# EAGLE design design (EAGLE 9.5.1)

## Sheet 1 of 2: DC/DC converters
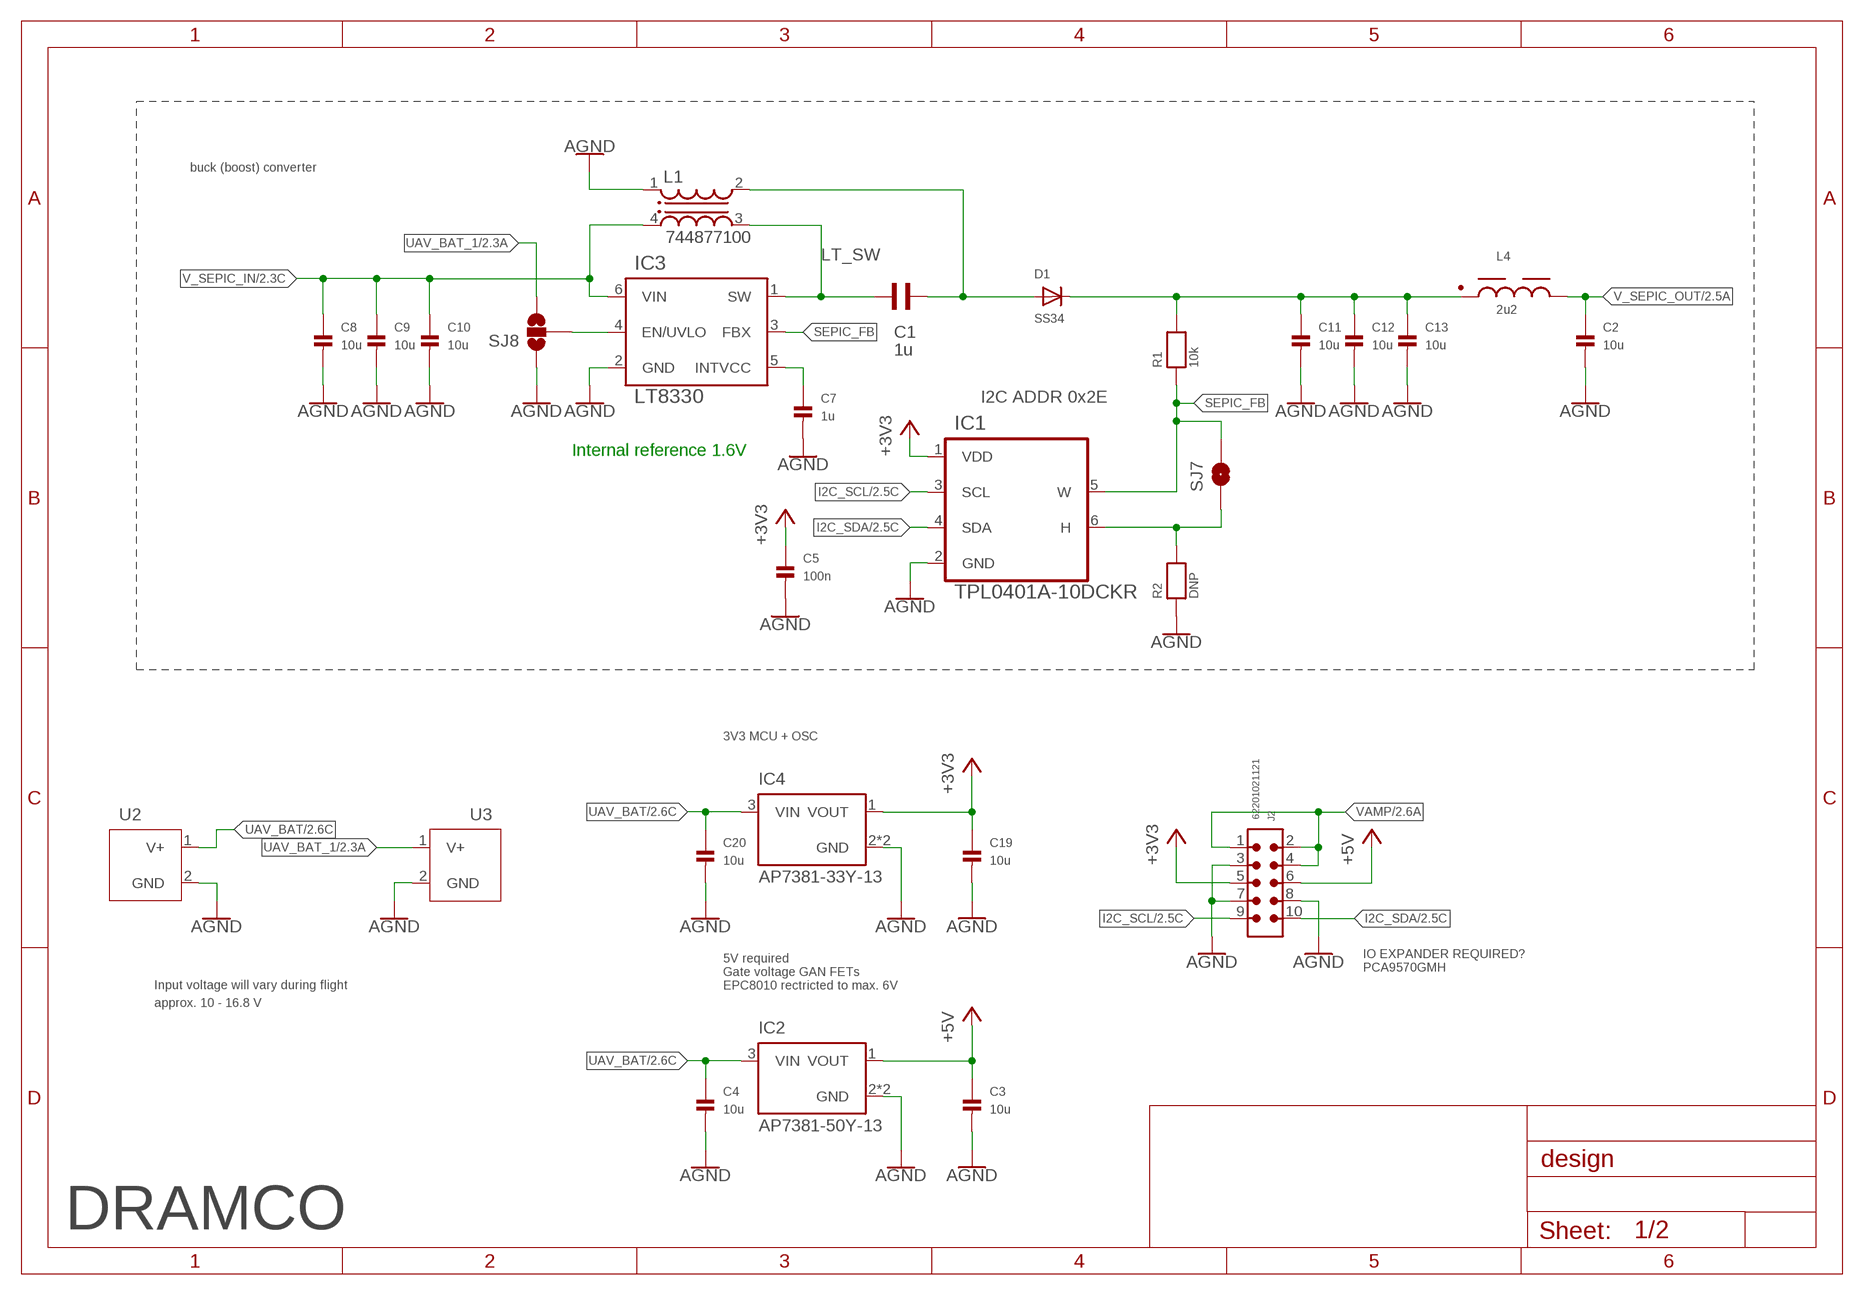
[diagram p0: schematic, sheet 1]

### Parts
C1  1u  WCAP-CSGP_0805_885012207103_WAVE  [WCAP-CSGP_0805_WAVE]
C2  10u  CAP_CERAMIC0805  [0805]
C3  10u  CAP_CERAMIC0603  [0603]
C4  10u  CAP_CERAMIC0603  [0603]
C5  100n  CAP_CERAMIC0402  [0402]
C7  1u  CAP_CERAMIC0603  [0603]
C8  10u  CAP_CERAMIC1206  [1206]
C9  10u  CAP_CERAMIC1206  [1206]
C10  10u  CAP_CERAMIC1206  [1206]
C11  10u  CAP_CERAMIC1206  [1206]
C12  10u  CAP_CERAMIC1206  [1206]
C13  10u  CAP_CERAMIC1206  [1206]
C19  10u  CAP_CERAMIC0603  [0603]
C20  10u  CAP_CERAMIC0603  [0603]
D1  SS34  DIODESOD-123  [SOD-123]
IC1  TPL0401A-10DCKR  [SOT65P210X110-6N]
IC2  AP7381-50Y-13  [FOOT_XC6201P332PR-G]
IC3  LT8330  LT8330ES6TR  [TSOT-23_S6]
IC4  AP7381-33Y-13  AP7381-50Y-13  [FOOT_XC6201P332PR-G]
J2  62201021121  6220XX21121_62201021121  [62201021121]
L1  744877100  WE-DD_7345_744877100  [WE-DD_7345]
L4  2u2  WE-LQS_3015_74404032022  [WE-LQS_3015]
R1  10k  RESISTOR0603  [0603]
R2  DNP  RESISTOR0603  [0603]
SJ7  SOLDERJUMPERNO  [SJ_2S-NO]
SJ8  SOLDERJUMPER_2WAYS  [SJ_3]
U2  UAV-CONNECT  [HOLE]
U3  UAV-CONNECT  [HOLE]

### Nets
+3V3: C5.1 C19.1 IC1.1(VDD) IC4.1(VOUT) J2.5 ; also sheet 2
+5V: C3.1 IC2.1(VOUT) J2.6 ; also sheet 2
AGND: C2.2 C3.2 C4.2 C5.2 C7.2 C8.2 C9.2 C10.2 C11.2 C12.2 C13.2 C19.2 C20.2 IC1.2(GND) IC2.2(GND) IC2.2.1(GND) IC3.2(GND) IC4.2(GND) IC4.2.1(GND) J2.3 J2.7 J2.8 L1.1 R2.1 SJ8.1 U2.2(GND) U3.2(GND) ; also sheet 2
I2C_SCL: IC1.3(SCL) J2.9 ; also sheet 2
I2C_SDA: IC1.4(SDA) J2.10 ; also sheet 2
LT_SW: C1.2 IC3.1(SW) L1.3
N$5: C7.1 IC3.5(INTVCC)
N$6: C1.1 D1.A L1.2
N$7: C11.1 C12.1 C13.1 D1.C L4.1 R1.2
N$8: IC3.4(EN/UVLO) SJ8.2
N$16: IC1.6(H) R2.2 SJ7.1
SEPIC_FB: IC1.5(W) IC3.3(FBX) R1.1 SJ7.2
UAV_BAT: C4.1 C20.1 IC2.3(VIN) IC4.3(VIN) U2.1(V+) ; also sheet 2
UAV_BAT_1: SJ8.3 U3.1(V+) ; also sheet 2
V_SEPIC_IN: C8.1 C9.1 C10.1 IC3.6(VIN) L1.4 ; also sheet 2
V_SEPIC_OUT: C2.1 L4.2 ; also sheet 2
VAMP: J2.1 J2.2 J2.4 ; also sheet 2

### Notes on the sheet
- buck (boost) converter
- I2C ADDR 0x2E
- Internal reference 1.6V
- 3V3 MCU + OSC
- IO EXPANDER REQUIRED?
  PCA9570GMH
- Input voltage will vary during flight
- 5V required
  Gate voltage GAN FETs
  EPC8010 rectricted to max. 6V
- approx. 10 - 16.8 V
- DRAMCO

## Sheet 2 of 2: Current/voltage sensing
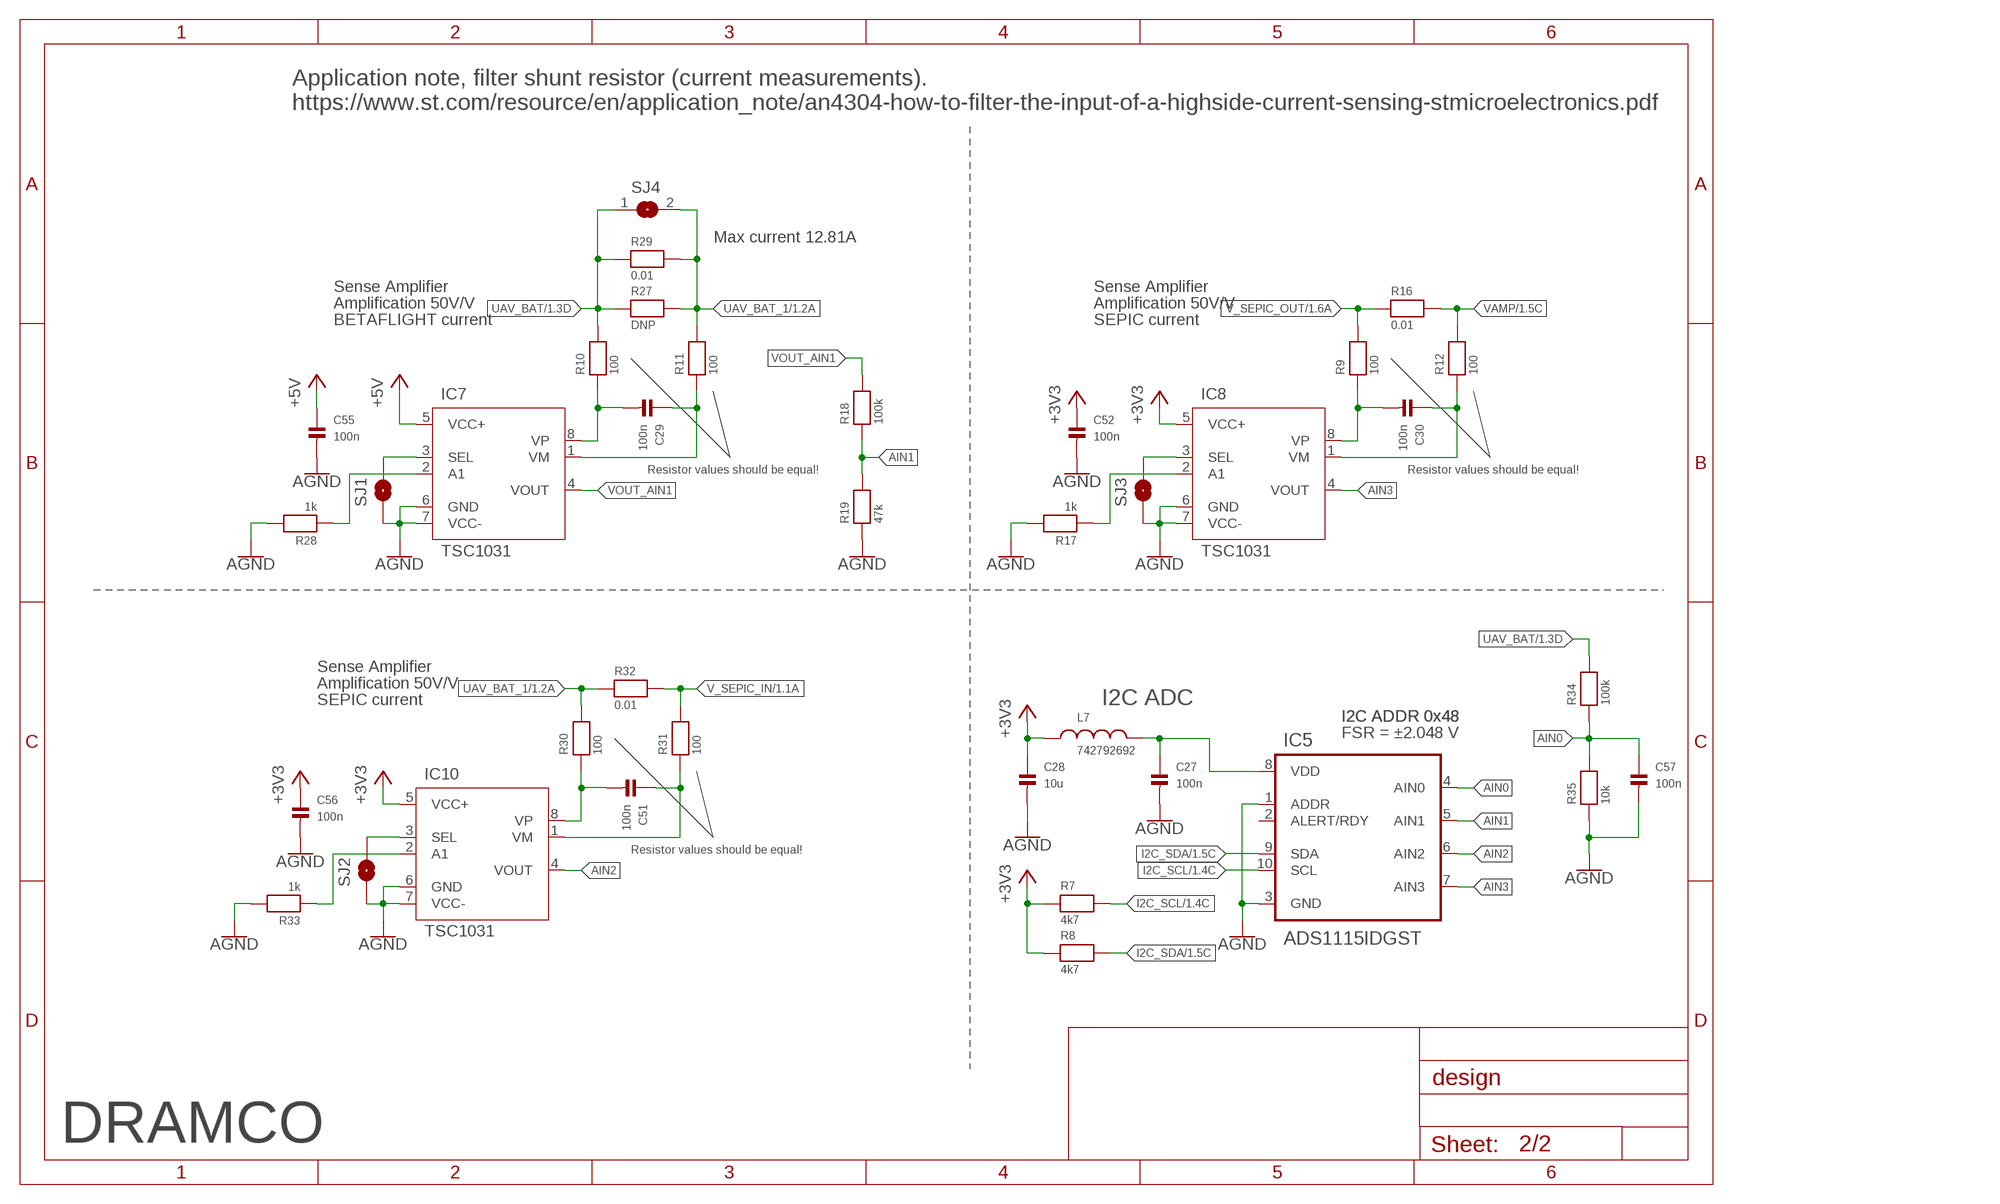
[diagram p1: schematic, sheet 2]

### Parts
C27  100n  CAP_CERAMIC0402  [0402]
C28  10u  CAP_CERAMIC0603  [0603]
C29  100n  CAP_CERAMIC0402  [0402]
C30  100n  CAP_CERAMIC0402  [0402]
C51  100n  CAP_CERAMIC0402  [0402]
C52  100n  CAP_CERAMIC0402  [0402]
C55  100n  CAP_CERAMIC0402  [0402]
C56  100n  CAP_CERAMIC0402  [0402]
C57  100n  CAP_CERAMIC0402  [0402]
IC5  ADS1115IDGST  [SOP50P490X110-10N]
IC7  TSC1031  TSC1031IPT  [SOP65P640X120-8N]
IC8  TSC1031  TSC1031IPT  [SOP65P640X120-8N]
IC10  TSC1031  TSC1031IPT  [SOP65P640X120-8N]
L7  742792692  WE-CBF_0603_742792692_WB_HS  [WE-CBF_0603(W=2.2)]
R7  4k7  RESISTOR0603  [0603]
R8  4k7  RESISTOR0603  [0603]
R9  100  RESISTOR0402  [0402]
R10  100  RESISTOR0402  [0402]
R11  100  RESISTOR0402  [0402]
R12  100  RESISTOR0402  [0402]
R16  0.01  RESISTOR0805  [0805]
R17  1k  RESISTOR0402  [0402]
R18  100k  RESISTOR0603  [0603]
R19  47k  RESISTOR0603  [0603]
R27  DNP  RESISTOR0805  [0805]
R28  1k  RESISTOR0402  [0402]
R29  0.01  RESISTOR0805  [0805]
R30  100  RESISTOR0402  [0402]
R31  100  RESISTOR0402  [0402]
R32  0.01  RESISTOR0805  [0805]
R33  1k  RESISTOR0402  [0402]
R34  100k  RESISTOR0603  [0603]
R35  10k  RESISTOR0603  [0603]
SJ1  SOLDERJUMPERTRACE  [SJ_2S-TRACE]
SJ2  SOLDERJUMPERTRACE  [SJ_2S-TRACE]
SJ3  SOLDERJUMPERTRACE  [SJ_2S-TRACE]
SJ4  SOLDERJUMPERREFLOW  [SOLDERJUMPER_REFLOW]

### Nets
+3V3: C28.1 C52.1 C56.1 IC8.5(VCC+) IC10.5(VCC+) L7.1 R7.1 R8.1 ; also sheet 1
+5V: C55.1 IC7.5(VCC+) ; also sheet 1
AGND: C27.2 C28.2 C52.2 C55.2 C56.2 C57.2 IC5.1(ADDR) IC5.3(GND) IC7.6(GND) IC7.7(VCC-) IC8.6(GND) IC8.7(VCC-) IC10.6(GND) IC10.7(VCC-) R17.2 R19.1 R28.2 R33.2 R35.1 SJ1.1 SJ2.1 SJ3.1 ; also sheet 1
AIN0: C57.1 IC5.4(AIN0) R34.1 R35.2
AIN1: IC5.5(AIN1) R18.1 R19.2
AIN2: IC5.6(AIN2) IC10.4(VOUT)
AIN3: IC5.7(AIN3) IC8.4(VOUT)
I2C_SCL: IC5.10(SCL) R7.2 ; also sheet 1
I2C_SDA: IC5.9(SDA) R8.2 ; also sheet 1
N$3: C30.1 IC8.1(VM) R12.1
N$4: C27.1 IC5.8(VDD) L7.2
N$11: C30.2 IC8.8(VP) R9.1
N$12: IC8.3(SEL) SJ3.2
N$13: IC8.2(A1) R17.1
N$25: IC7.3(SEL) SJ1.2
N$26: C29.1 IC7.1(VM) R11.1
N$27: C29.2 IC7.8(VP) R10.1
N$29: C51.1 IC10.1(VM) R31.1
N$30: C51.2 IC10.8(VP) R30.1
N$31: IC7.2(A1) R28.1
N$32: IC10.3(SEL) SJ2.2
N$33: IC10.2(A1) R33.1
UAV_BAT: R10.2 R27.1 R29.1 R34.2 SJ4.1 ; also sheet 1
UAV_BAT_1: R11.2 R27.2 R29.2 R30.2 R32.1 SJ4.2 ; also sheet 1
V_SEPIC_IN: R31.2 R32.2 ; also sheet 1
V_SEPIC_OUT: R9.2 R16.1 ; also sheet 1
VAMP: R12.2 R16.2 ; also sheet 1
VOUT_AIN1: IC7.4(VOUT) R18.2
Unconnected: IC5.2(ALERT/RDY)

### Notes on the sheet
- Application note, filter shunt resistor (current measurements). 
  https://www.st.com/resource/en/application_note/an4304-how-to-filter-the-input-of-a-highside-current-sensing-stmicroelectronics.pdf
- Max current 12.81A
- Sense Amplifier | Sense Amplifier
- Amplification 50V/V | Amplification 50V/V
- BETAFLIGHT current | SEPIC current
- Resistor values should be equal! | Resistor values should be equal!
- Sense Amplifier
- Amplification 50V/V
- SEPIC current | I2C ADC
- I2C ADDR 0x48 | I2C ADDR 0x48
- FSR = ±2.048 V
- Resistor values should be equal!
- DRAMCO

## Library data of the parts
C1 = Kondensatoren (rev17a):WCAP-CSGP_0805: WCAP-CSGP Ceramic Capacitors Characteristics Multilayer Ceramic Chip Capacitor Recommended soldering:Reflow, for 0603 and 0805 wave soldering is also allowed Operating temperature:-55 °C to +125 °C; Ceramic characteristics: Class I - NPO ; Class II -X7R, X5R High performance ceramic High capacitance stability Minimal aging Termination:Cu/Ni/Sn <http://katalog.we-online.de/media/images/eisos/WCAP-CSGP_pf2.jpg> Details see: http://katalog.we-online.de/en/pbs/WCAP-CSGP-0805? Created: 2015-01-28 2015 (C) Wurth Elektronik
C2-C5 C7-C13 C19 C20 C27-C30 C51 C52 C55-C57 = microbuilder:CAP_CERAMIC: Ceramic Capacitors 0402 - 0402 Surface Mount Capacitors 16pF 50V 5% [Digikey: 445-4899-2-ND] 18pF 50V 5% [Digikey: 490-1281-2-ND] 22pF 50V 5% [Digikey: 490-1283-2-ND] 68pF 50V 5% [Digikey: 490-1289-2-ND] 0.1uF 10V 10% [Digikey: 490-1318-2-ND] 1.0uF 6.3V 10% [Digikey: 490-1320-2-ND] 0603 - 0603 Surface Mount Capacitors 16 pF 50V 5% [Digikey: 445-5051-2-ND] 22 pF 50V [Digikey: PCC220ACVTR-ND] 33 pF 50V 5% [Digikey: 490-1415-1-ND] 56pF 50V 5% [Digikey: 490-1421-1-ND] 220pF 50V 5% [Digikey: 445-1285-1-ND] 680 pF 50V 2200 pF 50V 5% C0G [Digikey: 445-1297-1-ND] 5600 pF 100V 5% X7R [Digikey: 478-3711-1-ND] 0.1 µF 25V 10% [Digikey: PCC2277TR-ND] 0.22 µF 16V 10% X7R [Digikey: 445-1318-1-ND] 1.0 µF 25V 10% [Digikey: 445-5146-2-ND] 0603 - RF Specific 3pF 250V +/-0.1pF RF [Digikey: 712-1347-1-ND] 18 pF 250V 5% [Digikey: 478-3505-1-ND or 712-1322-1-ND] 56 pF 250V 5% C0G RF [Digikey: 490-4867-1-ND] 68 pF 250V RF [Digikey: 490-4868-1-ND] 0805 - 0805 Surface Mount Capacitors 220 pF 250V 2% RF Ceramic Capacitor [Digikey: 712-1398-1-ND] 1000 pF 50V 2% NP0 Ceramic Capacitor [Digikey: 478-3760-1-ND] 0.1 µF 25V 10% Ceramic Capacitor [Digikey: PCC1828TR-ND] 1.0 µF 16V 10% Ceramic Capacitor[Digikey: 490-1691-2-ND] 10.0 µF 10V 10% Ceramic Capacitor[Digikey: 709-1228-1-ND] 10.0 uF 16V 10% Ceramic Capacitor [Digikey: 478-5165-2-ND] 47 uF 6.3V 20% Ceramic Capacitor [Digikey: 587-1779-1-ND or 399-5506-1-ND] 1206 - 1206 Surface Mount Capacitors 47uF 10V 20% Ceramic Capacitor [Digikey: 490-5528-1-ND or 399-5508-1-ND or 445-6010-1-ND] 100uF 6.3V -20%, +80% Y5V Ceramic Capacitor (Digikey: 490-4512-1-ND, Mouser: 81-GRM31CF50J107ZE1L)
D1 = microbuilder:DIODE: Diode SMA Model Volts Amps Type Vf Vr Digikey # Notes SSA34-E3 40V 3A Schottky 480mV @ 3A 200uA @ 40V SSA34-E3/61TGITR-ND CDBA120-G 20V 1A Schottky 500mV @ 1A 500uA @ 20V 641-1014-6-ND REEL MBRA210 10V 2A Schottky 350mV @ 2A 700uA @ 10V MBRA210LT3 SOD-123 Model Volts Amps Type Vf Vr Order # Notes BAT54T1G 30V 200mA Schottky 800mV @ 200mA 2uA @ 25V BAT54T1GOSTR-ND B0530W 30V 500mA Schottky 430mV @ 500mA 130uA @ 30V B0530W-FDICT-ND REEL MBR120 1A 20V Schottky 340mV @ 1A MBR120VLSFT1GOSCT-ND SOD-323 Model Volts Amps Type Vf Vr Order # Notes PMEG2005EJ 20V 500mA Schottky 355mV @ 500mA 568-4110-1-ND ZLLS410 10V 570mA Schottky 380mV @ 570mA ZLLS410CT-ND 1N4148WS 75V 150mA Silicon/Simple 1V 1N4148WSFSCT-ND REEL SOD-523 Model Volts Amps Type Vf Vr Order # Notes BAT54XV2 30V 200mA Schottky 0.8V @ 100mA BAT54XV2CT-ND TB751S 30V 30mA Schottky RB751S-40TE61CT-ND SOT23-R/W (R = Solder Paste/Reflow Ovens, W = Hand-Soldering) Model Volts Amps Type Vf Vr Order # Notes BAT54FILM 40V 300mA Schottky 497-7162-1-ND
IC1 = TPL0401A-10DCKR:TPL0401A-10DCKR: Check availability <https://pricing.snapeda.com/parts/TPL0401A-10DCKR/Texas%20Instruments/view-part?ref=eda>; AVAILABILITY: In Stock; CHECK_PRICES: https://www.snapeda.com/parts/TPL0401A-10DCKR/Texas+Instruments/view-part/?ref=eda; DESCRIPTION: 128-tap single-channel digital potentiometer (digipot) with I2C interface (address 0101110); MF: Texas Instruments; MP: TPL0401A-10DCKR; PACKAGE: SOT-SC70-6 Texas Instruments; PRICE: None; PURCHASE-URL: https://pricing.snapeda.com/search?q=TPL0401A-10DCKR&ref=eda; SNAPEDA_LINK: https://www.snapeda.com/parts/TPL0401A-10DCKR/Texas+Instruments/view-part/?ref=snap
IC2 IC4 = AP7381:AP7381-50Y-13: 250mA CMOS LDO, Isupply 1uA and 2% Vout Accuracy 3 SOT-89 T/R; AVAILABILITY: Unavailable; DESCRIPTION: 250mA CMOS LDO, Isupply 1uA and 2% Vout Accuracy 3 SOT-89 T/R; MF: Microchip; MP: MCP1700T-3602E/MB; PACKAGE: SOT-89 Microchip; PRICE: None
IC3 = LT8330ES6TR:LT8330ES6TR: Check availability <https://pricing.snapeda.com/parts/LT8330ES6%23TR/Analog%20Devices/view-part?ref=eda>; AVAILABILITY: In Stock; CHECK_PRICES: https://www.snapeda.com/parts/LT8330ES6%23TR/Analog+Devices/view-part/?ref=eda; DESCRIPTION: Boost, SEPIC Switching Regulator IC Positive or Negative, Isolation Capable Adjustable 1.6V, -0.8V 1 Output 1A SOT-23-6 Thin, TSOT-23-6; MF: Analog Devices; MP: LT8330ES6#TR; PACKAGE: SOT-23-6 Linear Technology; PRICE: None; SNAPEDA_LINK: https://www.snapeda.com/parts/LT8330ES6%23TR/Analog+Devices/view-part/?ref=snap
IC5 = ADS1115IDGST:ADS1115IDGST: Analog-to-Digital Converter with Internal Reference; AVAILABILITY: Unavailable; DESCRIPTION: 16-Bit ADC with Integrated MUX, PGA, Comparator, Oscillator, and Reference 10-VSSOP -40 to 125; MF: Texas Instruments; MP: ADS1115IDGST; PACKAGE: MSOP-10 Texas Instruments; PRICE: None
IC7 IC8 IC10 = TSC1031:TSC1031IPT
J2 = Eagle_WR-PHD (rev22a):6220XX21121_62201021121: WR-PHD 1.27 mm THT Dual Pin Header ARTICLE PROPERTIES: Pins:4;​ 8;​ 10;​ 14;​ 16;​ 20;​ 28 KIND PROPERTIES: Pitch：1.27 mm Quality Class:3 as per CECC 75 301-802 Rows：Dual Gender：Pin Header Type：Straight MATERIAL PROPERTIES: Insulator Material :PA9T Insulator Flammability Rating:UL94 V-0 Contact Material:Copper Alloy Contact Plating:Gold Contact Type:Stamped GENERAL INFORMATION Operating Temperature:-40 up to +105 °C Compliance:Lead free / RoHS ELECTRICAL PROPERTIES: Rated Current:1 A;​ max. IR1:1 A Withstanding Voltage:500 V (AC) Contact Resistance:20 mΩ RISO:1000 MΩ CERTIFICATION UL Approval:E323964 PACKAGING PROPERTIES Packaging:Box Packaging Unit:1000;​ 800;​ 500;​ 200 <https://katalog.we-online.com/media/images/v2/o33223v209%20Family_WR-PHD_6220xx21121.jpg> Details see: https://katalog.we-online.com/en/em/PHD_1_27_THT_DUAL_PIN_HEADER_6220XX21121 Updated by Yingchun,Shan 2019-10-25 2019 (C) Würth Elektronik; DATASHEET-URL: https://www.we-online.com/redexpert/spec/62201021121?ae; GENDER: Pin Header; IR: 1A; MOUNT: THT; PACKAGING: Box; PART-NUMBER: 62201021121; PINS: 10; PITCH: 1.27mm; ROWS: Dual; TYPE: Straight
L1 = PowerMagnetics (rev18e):WE-DD_7345: WE-DD SMD Shielded Coupled Inductor Characteristics 1:1 transformer Double inductor with two identical windings 4 different sizes available Operating temperature: –40 ºC to +125 ºC Recommended solder profile: Reflow Custom designs on request Applications For SEPIC and CUK topologies Flyback applications Switching regulators with second, unregulated output voltages <http://katalog.we-online.de/media/images/v2/Family_WE-DD.jpg> Details see: http://katalog.we-online.de/en/pbs/WE-DD Updated by Dan Xu 2014-06-10 2014 (C) Wurth Elektronik; WE-NUMBER: 744877100/10uH
L4 = EMCComponents (rev19b):WE-LQS_3015: SMD Shielded Tiny Power Inductor Characteristics Tiny Power Inductor design 1.7 times more current in comparison with unshielded versions Robust design & high durability Low RDC Magnetically shielded with magnetic glue reducing buzz noise in ultra-low levels Operating Temperature: –40 °C to +125 °C Applications Integrated DC/DC Converters Switching controllers which required high efficiency Portable power (Smartphones, digital cameras, Tablets, etc.) Embedded laptops and PCs Big sizes (5040, 60xx, 8040) used for shock-proof circuits <http://katalog.we-online.de/media/images/v2/Family_WE-LQS.jpg> Details see: http://katalog.we-online.de/en/pbs/WE-LQS Created by Dan Xu 2014-05-21 2014 (C) Wurth Elektronik; WE-NUMBER: 74404032022/2,2uH
L7 = PowerMagnetics (rev18e):WE-CBF_0603: WE-CBF SMD EMI Suppression Ferrite Bead Characteristics Reliable Ni-Sn electrodes High rated current up to 6 A Operating temperature: –55 ºC to +125 ºC Applications Perfect as data lined filter and for uncoupling of distribution voltage Variant abbreviation WB means WIDE BAND HS means HIGH SPEED HC means HIGH CURRENT <http://katalog.we-online.de/media/images/v2/Family_WE-CBF.jpg> Details see: http://katalog.we-online.de/en/pbs/WE-CBF Updated on 2014-06-19 2014 (C) Wurth Elektronik; WE-NUMBER: 742792692/1800Ω(Z@100MHz)
R1 R2 R7-R12 R16-R19 R27-R35 = microbuilder:RESISTOR: Resistors 0402 - 0402 Surface Mount Package 22 Ohm 1% 1/16W [Digikey: 311-22.0LRTR-ND] 33 Ohm 5% 1/16W 1.0K 5% 1/16W 1.5K 5% 1/16W 2.0K 1% 1/16W 10.0K 1% 1/16W [Digikey: 311-10.0KLRTR-ND] 10.0K 5% 1/16W [Digikey: RMCF0402JT10K0TR-ND] 12.1K 1% 1/16W [Digikey: 311-22.0LRTR-ND] 100.0K 5% 1/16W 0603 - 0603 Surface Mount Package 0 Ohm 1/10 Watt 1% Resistor 15 Ohm 1/10 Watt 1% Resistor 33 Ohm 1/10 Watt 1% Resistor 49.9 Ohm 1/10 Watt 1% Resistor 100 Ohm 1/10 Watt 1% Resistor 150 Ohm 1/10 Watt 1% Resistor 240 Ohm 1/10 Watt 1% Resistor 390 Ohm 1/10 Watt 1% Resistor 560 Ohm 1/10 Watt 1% Resistor 680 Ohm 1/10 Watt 1% Resistor 750 Ohm 1/10 Watt 1% Resistor 1.0K Ohm 1/10 Watt 1% Resistor 1.5K Ohm 1/10 Watt 1% Resistor 2.0K Ohm 1/10 Watt 1% Resistor 2.2K Ohm 1/10 Watt 1% Resistor 3.3K Ohm 1/10 Watt 1% Resistor 4.7K Ohm 1/10 Watt 1% Resistor 10.0K Ohm 1/10 Watt 1% Resistor 12.0K Ohm 1/10 Watt 1% Resistor 12.1K Ohm 1/10 Watt 1% Resistor 20.0K Ohm 1/10 Watt 1% Resistor 33.0K Ohm 1/10 Watt 1% Resistor 100.0K Ohm 1/10 Watt 1% Resistor 0805 - 0805 Surface Mount Package 0 Ohm 1/8 Watt 1% Resistor 33 Ohm 1/8 Watt 1% Resistor 100 Ohm 1/8 Watt 1% Resistor 150 Ohm 1/8 Watt 1% Resistor 200 Ohm 1/8 Watt 1% Resistor 240 Ohm 1/8 Watt 1% Resistor 330 Ohm 1/8 Watt 1% Resistor 390 Ohm 1/8 Watt 1% Resistor 470 Ohm 1/8 Watt 1% Resistor 1.0K Ohm 1/8 Watt 1% Resistor 1.5K Ohm 1/8 Watt 1% Resistor 2.0K Ohm 1/8 Watt 1% Resistor 4.7K Ohm 1/8 Watt 1% Resistor 5.1K Ohm 1/8 Watt 1% Resistor 5.6K Ohm 1/8 Watt 1% Resistor 10.0K Ohm 1/8 Watt 1% Resistor 22.0K Ohm 1/8 Watt 1% Resistor 33.0K Ohm 1/8 Watt 1% Resistor 100K Ohm 1/8 Watt 1% Resistor 1206 - 1206 Surface Mount Package 2012 - 2010 Surface Mount Package 0.11 Ohm 1/2 Watt 1% Resistor - Digikey: RHM.11UCT-ND
SJ1-SJ3 SJ7 = SparkFun-Retired:SOLDERJUMPER: Solder Jumper Standard SMD solder jumper. Used to automate production. Two varients : Normally Open and Normally Closed are the same, but have different paste layers. NC will have a large amount of paste and should jumper during reflow.
SJ4 = microbuilder:SOLDERJUMPER: SMD Solder JUMPER Solder the two pads together to create a connection, or remove the solder to break it. REFLOW - Use this footprint for solder paste and reflow ovens. WAVE - Use this footprint for hand-soldering (larger pads). CLOSED - Has a trace between the two pads to ensure it is closed by default. The trace needs to be cut to disable the jumper, and can be closed again by creating a solder bridge between the two pads.
SJ8 = SparkFun-Retired:SOLDERJUMPER_2WAY: Solder Jumper 2 way solder jumper
U2 U3 = UAV-connector:UAV-CONNECT

## Board
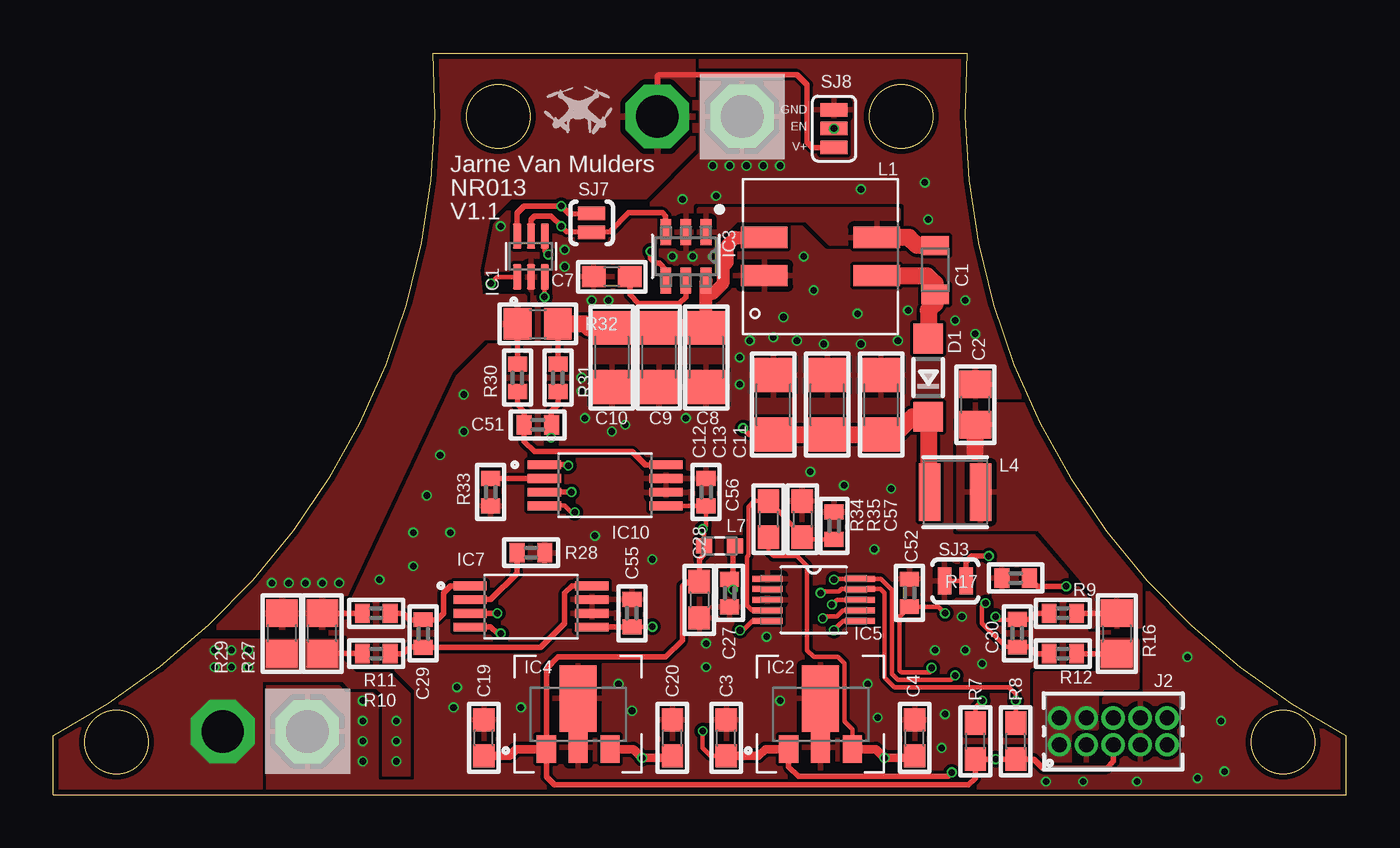
[diagram p2: board, top side]
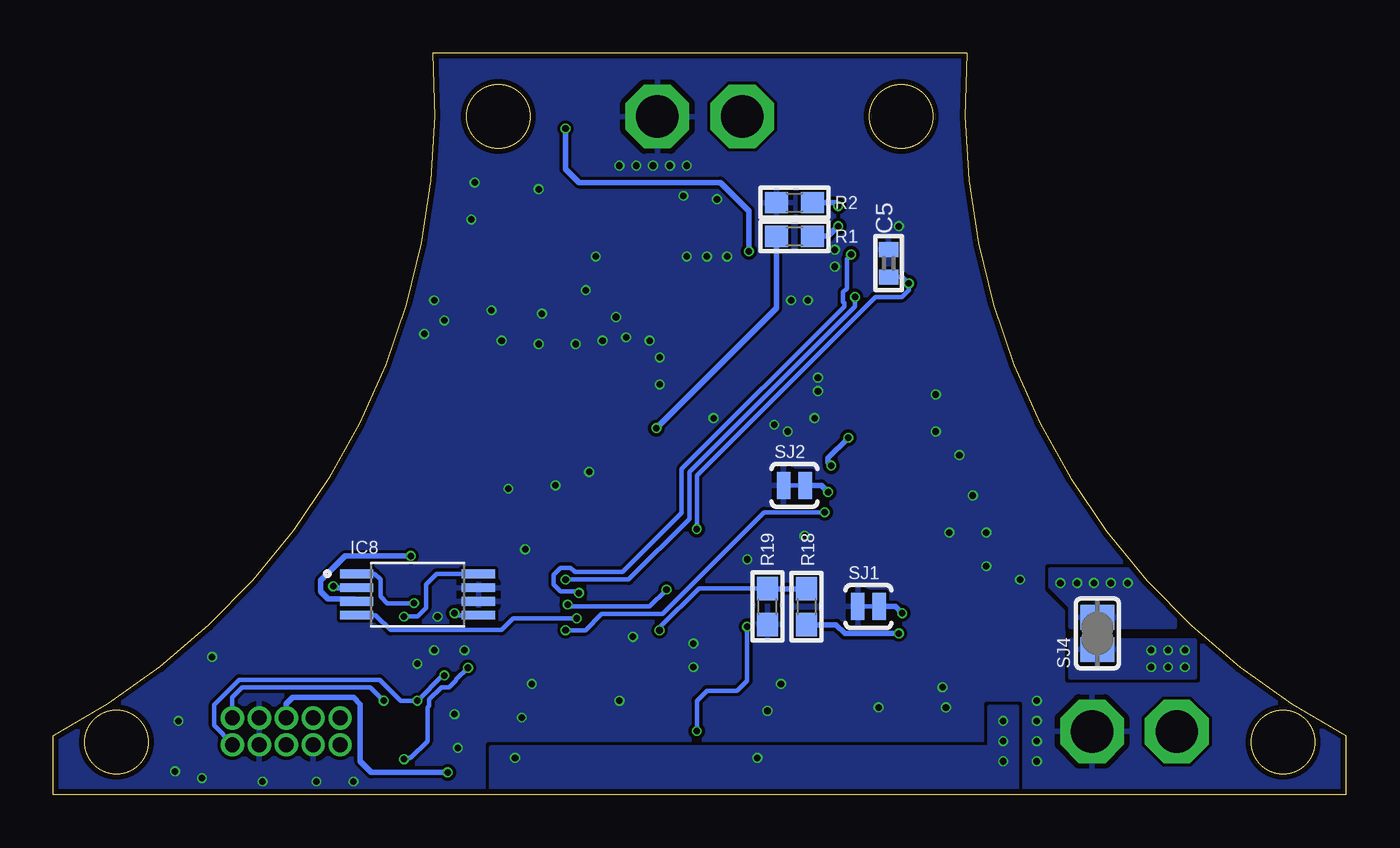
[diagram p3: board, bottom side, seen from below]

Size 61 x 35 mm. Coordinates in mm from the lower left corner, seen from the top.
Outline: 0,0 61,0 61,2.8 arc-67 43.1,35 17.9,35 arc-67 0,2.8 0,0
Outline: circle at 3,2.5 radius 1.5
Outline: circle at 58,2.5 radius 1.5
Outline: circle at 21,32 radius 1.5
Outline: circle at 40,32 radius 1.5
Copper layers (1*16): Top 0.035mm / dielectric 1.5mm / Bottom 0.035mm
Design rules "SeeedStudio_2layer_DRU_no_angle_20140221 *": minimum track width 6mil, minimum drill 12mil, track to track 6mil, track to pad 6mil, pad to pad 6mil, via to via 6mil, smd to smd 0mil, copper to edge 10mil, drill to drill 10mil, minimum pad ring 6mil, minimum via ring 2mil, stop-mask expansion 2mil, vias tented up to drill 100mil, thermal gap 10mil

### Footprints (pad centres in the part's own frame; a part is rotated, then mirrored left to right if it is on the bottom)
WCAP-CSGP_0805_WAVE = smd 0.9 x 1.3: 1 -1.15,0; 2 1.15,0
0805 = smd 1.3 x 1.5: 1 -0.95,0; 2 0.95,0
0603 = smd 1.1 x 1: 1 -0.85,0; 2 0.85,0
0402 = smd 0.7 x 0.9: 1 -0.65,0; 2 0.65,0
1206 = smd 1.6 x 1.8: 1 -1.4,0; 2 1.4,0
SOD-123 = smd 1.4 x 1.4: A 1.85,0; C -1.85,0
SOT65P210X110-6N = smd 1.19 x 0.4: 1 -0.96,0.65; 2 -0.96,0; 3 -0.96,-0.65; 4 0.96,-0.65; 5 0.96,0; 6 0.96,0.65
FOOT_XC6201P332PR-G = smd 0.9 x 1.3: 1 -1.5,-1.65; 3 1.5,-1.65 | smd 0.9 x 1.475: 2 0,-1.562 | smd 1.733 x 3.125: 2.1 0,0.738
TSOT-23_S6 = smd 1.219 x 0.508: 1 -1.143,0.95; 2 -1.143,0; 3 -1.143,-0.95; 4 1.143,-0.95; 5 1.143,0; 6 1.143,0.95
SOP50P490X110-10N = smd 1.422 x 0.279: 1 -2.184,0.991; 2 -2.184,0.508; 3 -2.184,0; 4 -2.184,-0.508; 5 -2.184,-0.991; 6 2.184,-0.991; 7 2.184,-0.508; 8 2.184,0; 9 2.184,0.508; 10 2.184,0.991
SOP65P640X120-8N = smd 1.57 x 0.41: 1 -2.87,0.975; 2 -2.87,0.325; 3 -2.87,-0.325; 4 -2.87,-0.975; 5 2.87,-0.975; 6 2.87,-0.325; 7 2.87,0.325; 8 2.87,0.975
62201021121 = drill 0.7 pad 1.1: 1 -2.54,-0.635; 2 -2.54,0.635; 3 -1.27,-0.635; 4 -1.27,0.635; 5 0,-0.635; 6 0,0.635; 7 1.27,-0.635; 8 1.27,0.635; 9 2.54,-0.635; 10 2.54,0.635
WE-DD_7345 = smd 2.2 x 1: 1 -2.65,-0.9; 2 2.65,-0.9; 3 2.65,0.9; 4 -2.65,0.9
WE-LQS_3015 = smd 1 x 2.7: 1 -1.2,0; 2 1.2,0
WE-CBF_0603(W=2.2) = smd 0.75 x 0.7: 1 -0.725,0; 2 0.725,0
SJ_2S-TRACE = smd 0.635 x 1.27: 1 -0.508,0; 2 0.508,0
SOLDERJUMPER_REFLOW = smd 1.168 x 1.6: 1 -0.762,0; 2 0.762,0
SJ_2S-NO = smd 0.635 x 1.27: 1 -0.45,0; 2 0.45,0
SJ_3 = smd 0.635 x 1.27: 1 -0.889,0; 2 0,0; 3 0.889,0
HOLE = drill 2 octagon: 1 -2,0; 2 2,0

### Placement (x,y rotation side)
C1  41.59,24.77 90 top
C2  43.5,18.41 90 top
C3  31.75,2.7 90 top
C4  40.64,2.7 90 top
C5  21.59,25.08 90 bottom
C7  26.35,24.45 180 top
C8  30.8,20.64 270 top
C9  28.57,20.64 270 top
C10  26.35,20.64 270 top
C11  39.05,18.41 90 top
C12  33.97,18.41 90 top
C13  36.51,18.41 90 top
C19  20.32,2.7 90 top
C20  29.21,2.7 90 top
C27  31.91,9.53 270 top
C28  30.48,9.21 270 top
C29  17.46,7.62 270 top
C30  45.47,7.63 90 top
C51  22.86,17.46 180 top
C52  40.39,9.53 90 top
C55  27.3,8.57 90 top
C56  30.8,14.29 90 top
C57  36.83,12.7 90 top
D1  41.27,19.68 90 top
IC1  22.54,25.4 90 top
IC2  36.2,3.81 0 top
IC3  29.84,25.4 270 top
IC4  24.77,3.81 0 top
IC5  35.88,9.21 0 top
IC7  22.54,8.89 0 top
IC8  43.81,9.46 0 bottom
IC10  26.04,14.61 0 top
J2  50,3 0 top
L1  36.2,25.4 0 top
L4  42.55,14.29 0 top
L7  31.43,11.75 0 top
R1  26.04,26.35 180 bottom
R2  26.04,27.94 0 bottom
R7  43.5,2.54 90 top
R8  45.4,2.54 90 top
R9  47.62,8.57 0 top
R10  15.24,6.67 180 top
R11  15.24,8.57 180 top
R12  47.62,6.67 0 top
R16  50.16,7.62 270 top
R17  45.4,10.23 180 top
R18  25.47,8.88 270 bottom
R19  27.3,8.89 90 bottom
R27  12.7,7.62 90 top
R28  22.54,11.43 0 top
R29  10.79,7.62 90 top
R30  21.91,19.68 90 top
R31  23.81,19.68 90 top
R32  22.86,22.23 0 top
R33  20.64,14.29 270 top
R34  33.74,13.01 270 top
R35  35.33,13.01 270 top
SJ1  22.54,8.89 0 bottom
SJ2  26.04,14.61 0 bottom
SJ3  42.55,10.09 0 top
SJ4  11.75,7.62 90 bottom
SJ7  25.4,26.99 270 top
SJ8  36.83,31.43 270 top
U2  10,3 0 top
U3  30.5,32 0 top

### Tracks (layer width: path | path; a pad name or v marks a point on that pad's centre or on a via)
+3V3  (via drill 0.31)
  Top 0.203: L7.1 30.71,12.47 v30.64,12.54 30.8,12.7 30.8,13.49 | v20.64,24.13 20.95,24.44 IC1.1 | C56.1 30.8,13.49 | IC10.5 30.66,13.63 30.8,13.49 | v41.43,6 41.43,5.87 41.35,5.79 40.01,5.79 39.92,5.87 39.92,8.41 C52.1 41.76,8.88 v42.07,8.57
  Top 0.254: J2.5 50.01,2.36 50.01,1.59 49.69,1.27 46.67,1.27 46.25,1.69 R8.1 v44.45,1.69 R7.1 43.5,0.79 43.18,0.48 23.65,0.48 23.27,0.86 IC4.1 23.27,5.96 23.81,6.51 28.89,6.51 29.69,7.3 29.69,9.84 29.9,10.06 C28.1 30.48,11.11 30.71,11.34 L7.1
  Top 0.406: IC4.1 21.84,2.16 21.53,1.85 C19.1
  Bottom 0.203: v30.64,12.54 30.64,15.08 22.23,23.5 20.95,23.5 20.64,23.81 v20.64,24.13 20.94,24.43 C5.1 | v41.43,6 41.98,5.45 41.98,5.41 42.31,5.08 42.68,5.08 43.25,4.5 43.25,4.21 43.34,4.13 43.34,2.54 44.13,1.75 44.45,1.75 v44.45,1.69 | v42.07,8.57 41.98,8.48 IC8.5
+5V  (via drill 0.31)
  Top 0.152: IC7.5
  Top 0.203: C55.1 28.08,7.92 28.1,7.94 v28.27,7.94 | v30.64,3.02 30.64,2.22 31.01,1.85 C3.1
  Top 0.254: C55.1 IC7.5 | IC2.1 34.7,1.34 35.15,0.88 42.21,0.88 v42.39,1.06
  Top 0.406: IC2.1 33.59,2.16 33.28,1.85 C3.1
  Bottom 0.203: v28.27,7.94 28.27,5.39 28.73,4.92 30.16,4.92 30.64,4.45 v30.64,3.02
  Bottom 0.254: v42.39,1.06 45.99,1.06 46.51,1.59 46.51,4.29 46.83,4.6 49.69,4.6 50,4.29 J2.6
AGND  (via drill 0.31)
  other vias: 14.61,4.45 14.61,3.49 14.61,2.54 14.61,1.59 29.21,25.4 30.16,25.4 31.11,25.4 21.11,26.83 24.13,25.72 24.13,24.92 38.89,3.65 38.42,5.24 34.29,4.45 33.66,7.46 30.8,6.03 30.8,7.14 42.86,8.41 29.84,17.78 25.08,17.78 26.35,17.14 26.99,17.46 24.92,19.05 24.92,19.68 25.4,23.34 26.19,23.34 32.38,19.37 32.38,20.64 32.86,21.43 35.08,21.43 36.35,21.27 33.97,21.59 38.1,21.27 37.94,22.7 34.45,22.54 35.88,23.81 35.4,25.4 38.1,28.57 31.27,28.26 29.69,28.1 41.12,28.89 41.27,27.15 43.02,23.34 43.5,21.75 42.55,22.38 39.85,21.43 40.32,22.86 46.83,0.64 48.58,0.64 51.12,0.64 53.98,0.79 55.09,3.49 53.5,6.51 55.24,1.11 18.89,4.13 19.05,5.08 22.07,4.13 27.3,3.97 26.67,5.24 16.99,10.79 18.73,12.38 17.62,14.13 19.37,17.14 19.37,18.89 18.26,16.03 15.4,10.16 31.11,29.69 31.91,29.69 32.7,29.69 33.5,29.69 34.29,29.69 25.56,12.22 28.26,11.11 37.31,14.61 35.72,15.24 39.53,14.45 38.73,11.59 41.59,6.83 43.81,6.19 43.02,6.83 41.91,2.22 42.07,3.81 16.99,12.38
  pour Bottom (rank 6): -2.86,39.37 65.41,39.37 65.41,-3.81 -2.86,-3.81
  pour Top (rank 6): -7.94,40.64 -7.94,-3.49 67.31,-3.49 67.31,40.64
AIN0
  Top 0.203: C57.1 35.44,12.05 R35.2 35.33,12.27 R34.1 33.07,13.86 32.79,13.58 32.79,11.29 32.73,11.23 32.73,8.93 32.96,8.7 IC5.4
AIN1  (via drill 0.31)
  Top 0.203: IC5.5 32.98,8.22 32.53,7.77 v32.4,7.77
  Bottom 0.203: v32.4,7.77 32.4,7.9 30.55,9.75 27.32,9.75 R19.2
  Bottom 0.254: R18.1 R19.2
AIN2  (via drill 0.31)
  Top 0.203: IC5.6 37.27,8.22 37.11,8.06 v36.83,7.78 v36.83,7.77 | v24.61,13.34 24.45,13.34 24.13,13.65 23.19,13.65 IC10.4
  Bottom 0.203: v36.83,7.77 35.89,7.77 35.12,8.53 32.26,8.53 27.46,13.34 v24.61,13.34
AIN3  (via drill 0.31)
  Top 0.203: IC5.7 37.25,8.7 36.97,8.42 36.36,8.42 36.3,8.36 v36.3,8.33
  Bottom 0.203: v36.3,8.33 39.3,8.33 39.85,7.78 45.09,7.78 45.79,8.48 IC8.4
I2C_SCL  (via drill 0.31)
  Top 0.203: IC1.3 23.19,23.51 v23.18,23.5 | v36.83,10.16 36.87,10.2 IC5.10 39.04,10.2 39.57,9.67 39.57,5.71 39.85,5.44 42.34,5.44 v42.55,5.64 | v43.81,4.45 43.5,4.13 R7.2
  Bottom 0.203: v23.18,23.5 23.18,23.05 30.99,15.23 30.99,13.02 33.85,10.16 v36.83,10.16 | J2.9 52.54,2.42 53.4,3.28 53.4,4.25 52.22,5.44 45.6,5.44 44.61,4.45 v43.81,4.45 42.62,5.64 v42.55,5.64
I2C_SDA  (via drill 0.31)
  Top 0.203: IC1.4 23.19,25.66 v23.36,25.5 | v36.2,9.53 36.27,9.6 37.06,9.6 37.18,9.72 IC5.9 39.02,9.72 39.21,9.53 39.21,5.56 39.69,5.08 45.09,5.08 45.4,4.76 v45.4,4.45 R8.2
  Bottom 0.203: v23.36,25.5 23.57,25.29 23.57,23.9 23.74,23.73 23.74,23.26 23.68,23.2 23.68,23.05 31.35,15.38 31.35,13.3 34.13,10.52 36.39,10.52 36.6,10.72 37.06,10.72 37.39,10.39 37.39,9.93 37.06,9.6 36.27,9.6 v36.2,9.53 | J2.10 52.54,4.61 52.07,5.08 46.04,5.08 v45.4,4.45
LT_SW
  Top 0.813: L1.3 40.38,26.3 40.76,25.91 C1.2
  pour Top: 30.48,27.62 39.85,27.62 39.85,26.01 36.67,26.04 35.56,27.15 32.23,27.15 31.14,26.06 30.78,26.06 30.48,26.35
N$3  (via drill 0.31)
  Top 0.203: C30.1 44.93,6.98 43.81,8.1 43.81,8.89 v43.97,9.05
  Top 0.254: C30.1 46.05,6.98 46.35,6.67 R12.1
  Bottom 0.203: v43.97,9.05 45.24,9.05 45.56,9.37 45.56,10.16 45.83,10.43 IC8.1
N$4  (via drill 0.31)
  Top 0.203: v36.73,8.98 36.96,9.21 IC5.8 | v32.07,9.69 31.91,9.84 C27.1
  Top 0.254: C27.1 32.07,10.33 32.07,11.66 L7.2
  Bottom 0.203: v32.07,9.69 32.86,8.89 36.65,8.89 v36.73,8.98
N$5
  Top 0.254: IC3.5 29.84,23.5 29.53,23.18 27.62,23.18 27.2,23.6 C7.1
N$6
  Top 0.813: D1.A 41.27,22.86 41.59,23.18 C1.1 41.59,24.13 41.22,24.5 L1.2
N$7  (via drill 0.31)
  Top 0.254: C12.1 32.83,17.02 v32.54,17.3
  Top 0.813: C12.1 C13.1 C11.1 39.72,17.02 40.54,17.84 D1.C 41.27,14.36 L4.1
  Bottom 0.254: v32.54,17.3 26.89,22.96 R1.2
N$8  (via drill 0.31)
  Top 0.254: IC3.4 28.89,24.79 28.6,25.08 28.42,25.08 28.18,25.32 v28.18,25.64
  Bottom 0.254: SJ8.2 36.83,29.53 36.2,28.89 29.53,28.89 28.18,27.55 v28.18,25.64
  other vias: 36.83,31.43
N$11  (via drill 0.31)
  Top 0.203: v44.45,8.41 44.61,8.26 45.45,8.26 C30.2
  Top 0.254: C30.2 46.06,8.28 46.35,8.57 R9.1
  Bottom 0.203: 43.81,8.41 v44.45,8.41 | 43.81,8.41 | 43.81,8.41 43.41,8.82 43.41,9.93 42.91,10.43 IC8.8
N$12  (via drill 0.31)
  Top 0.254: v44.13,11.27 43.34,11.27 43.06,10.99 SJ3.2
  Bottom 0.254: IC8.3 46.8,9.26 48.03,9.26 48.37,9.6 48.37,10.12 47.22,11.27 v44.13,11.27
N$13  (via drill 0.31)
  Top 0.254: R17.1 46.43,9.84 v47.78,9.84
  Bottom 0.254: v47.78,9.84 47.72,9.78 IC8.2
N$16  (via drill 0.31)
  Top 0.254: IC1.6 21.89,27.45 22.23,27.78 v23.97,27.78 24.35,27.4 SJ7.1
  Bottom 0.254: v23.97,27.78 24.13,27.94 R2.2
N$25  (via drill 0.31)
  Top 0.152: IC7.3
  Top 0.254: IC7.3 v20.95,8.57
  Bottom 0.254: v20.95,8.57 21.27,8.89 SJ1.2
N$26
  Top 0.152: 17.45,8.26 C29.1
  Top 0.254: R11.1 16.51,8.57 16.83,8.26 17.45,8.26 | C29.1 18.11,8.27 18.41,8.57 18.41,9.53 18.75,9.87 IC7.1
N$27
  Top 0.152: 17.45,6.99 C29.2
  Top 0.254: R10.1 16.51,6.67 16.83,6.99 17.45,6.99 | C29.2 23,6.97 24.13,8.1 24.13,9.53 24.47,9.87 IC7.8
N$29  (via drill 0.31)
  Top 0.254: R31.1 23.81,18.41 23.5,18.1 23.5,17.48 C51.1 v23.51,16.84 23.5,16.83 v23.5,16.85 | v24.3,15.54 24.25,15.58 IC10.1
  Bottom 0.254: v23.5,16.85 24.45,15.9 24.45,15.68 v24.3,15.54
N$30
  Top 0.254: R30.1 21.91,18.41 22.23,18.1 22.23,17.48 C51.2 22.23,17.45 22.23,16.67 22.7,16.19 27.3,16.19 27.94,15.56 28.88,15.56 IC10.8
N$31
  Top 0.254: IC7.2 20.64,9.21 21.89,10.46 R28.1
N$32  (via drill 0.31)
  Top 0.254: IC10.3 23.17,14.29 v24.45,14.29
  Bottom 0.254: v24.45,14.29 24.77,14.61 SJ2.2
N$33
  Top 0.254: R33.1 IC10.2
SEPIC_FB  (via drill 0.31)
  Top 0.254: IC1.5 22.54,27.15 22.7,27.3 23.5,27.3 v23.97,26.83 24.22,26.58 SJ7.2 26.26,26.58 27.15,27.46 28.73,27.46 28.89,27.3 IC3.3
  Bottom 0.254: R1.1 24.45,26.35 v23.97,26.83
UAV_BAT  (via drill 0.31)
  Top 0.152: R10.2
  Top 0.203: R34.2 33.74,11.5 33.97,11.27 35.08,11.27 35.56,10.79 35.56,6.83 35.88,6.51 37.02,6.51 37.32,6.21 37.32,3.48 37.7,3.1 IC2.3
  Top 0.254: R27.1 R10.2
  Top 0.406: IC4.3 27.37,2.16 v27.78,1.75 29.11,1.75 C20.1 | IC2.3 38.8,2.16 v39.21,1.75 40.54,1.75 C4.1
  other vias: 16.19,2.54 16.19,1.59 16.19,3.49 7.62,6.83 7.62,6.03 8.41,6.03 9.21,6.03 9.21,6.83 8.41,6.83
  pour Top (no thermals): 9.84,-0.64 9.84,5.4 13.65,5.4 13.97,5.08 15.24,5.08 15.56,4.76 15.56,0.95 16.83,0.95 16.83,4.76 15.88,5.71 14.29,5.71 13.65,6.35 13.65,7.3 -1.59,7.3 -1.59,-0.64
  pour Bottom: 15.56,-1.27 15.56,4.13 16.83,4.13 16.83,2.22 40.32,2.22 40.32,-1.27
  pour Bottom: 7.14,7.3 13.02,7.3 13.02,5.56 7.14,5.56
UAV_BAT_1  (via drill 0.31)
  Top 0.152: R27.2
  Top 0.254: R27.2 R11.2 | R30.2 R32.1 | SJ8.3 35.81,30.54 35.56,30.8 35.56,33.5 35.08,33.97 28.57,33.97 28.5,33.9 U3.1
  other vias: 10.32,10 11.11,10 11.91,10 12.7,10 13.49,10
  pour Top: 5.4,7.94 13.65,7.94 13.65,9.21 18.73,20 20.32,21.59 22.23,21.59 22.23,23.5 20.13,23.5 20,24.77 20.48,27.15 21.59,28.26 27.94,28.26 30.16,30.48 30.16,36.2 5.4,36.2
  pour Bottom (rank 2): 8.1,7.94 13.02,7.94 13.02,8.89 13.97,9.84 13.97,10.64 8.1,10.64
V_SEPIC_IN
  Top 0.254: R31.2 23.81,21.59 23.97,21.75 23.97,22.06 R32.2
  Top 0.61: C8.1 30.8,23.65 | 30.8,23.65 IC3.6 | L1.4 32.17,26.3 31.8,25.93 31.8,25.11 31.59,24.9 31.59,24.13 31.11,23.65 30.8,23.65
  Top 0.813: C8.1 C9.1 C10.1 25.27,22.04 25.08,22.23 R32.2
V_SEPIC_OUT
  Top 0.254: R9.2 R16.1
  Top 0.813: 43.5,16.19 C2.1
  pour Top: 42.7,18.41 51.28,18.41 51.28,7.94 49.05,7.94 49.05,9.53 46.49,12.54 42.7,12.54
VAMP
  Top 0.254: R12.2 R16.2
  pour Top (no thermals): 46.35,1.59 46.35,5.71 49.53,5.71 49.53,7.3 51.12,7.3 51.12,5.08 49.53,5.08 49.21,4.76 49.21,3.17 48.26,3.17 47.94,2.86 47.94,1.59
VOUT_AIN1  (via drill 0.31)
  Top 0.254: v21.11,7.62 20.95,7.62 20.64,7.94 19.7,7.94 IC7.4
  Bottom 0.254: R18.2 24.07,8.03 23.65,7.62 v21.11,7.62

### Text on the board
tPlace: GND | EN | V+ | Jarne Van Mulders | NR013 | V1.1